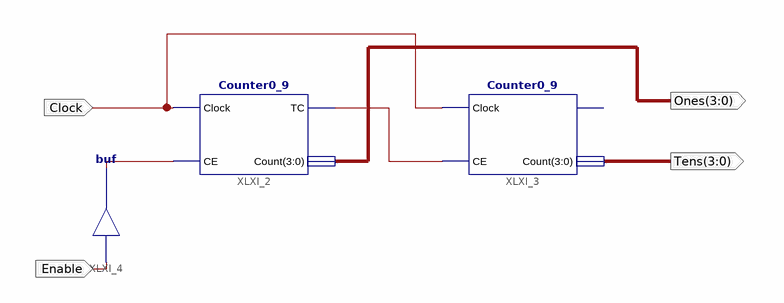
[diagram p0: schematic sheet 1]
// Xilinx ISE schematic Counter00_99.sch (spartan6) as structural Verilog: 3 symbols, 4 ports
module Counter00_99 (
  input  Clock,
  input  Enable,
  output [3:0] Ones,
  output [3:0] Tens
);

  wire XLXN_15, XLXN_17;

  Counter0_9 XLXI_2 (.Clock(Clock), .CE(XLXN_17), .Count(Ones), .TC(XLXN_15));
  Counter0_9 XLXI_3 (.Clock(Clock), .CE(XLXN_15), .Count(Tens));  // open: TC
  buf XLXI_4 (XLXN_17, Enable);
endmodule
